# EAGLE design cnc-ctrl-io (EAGLE 6.4)
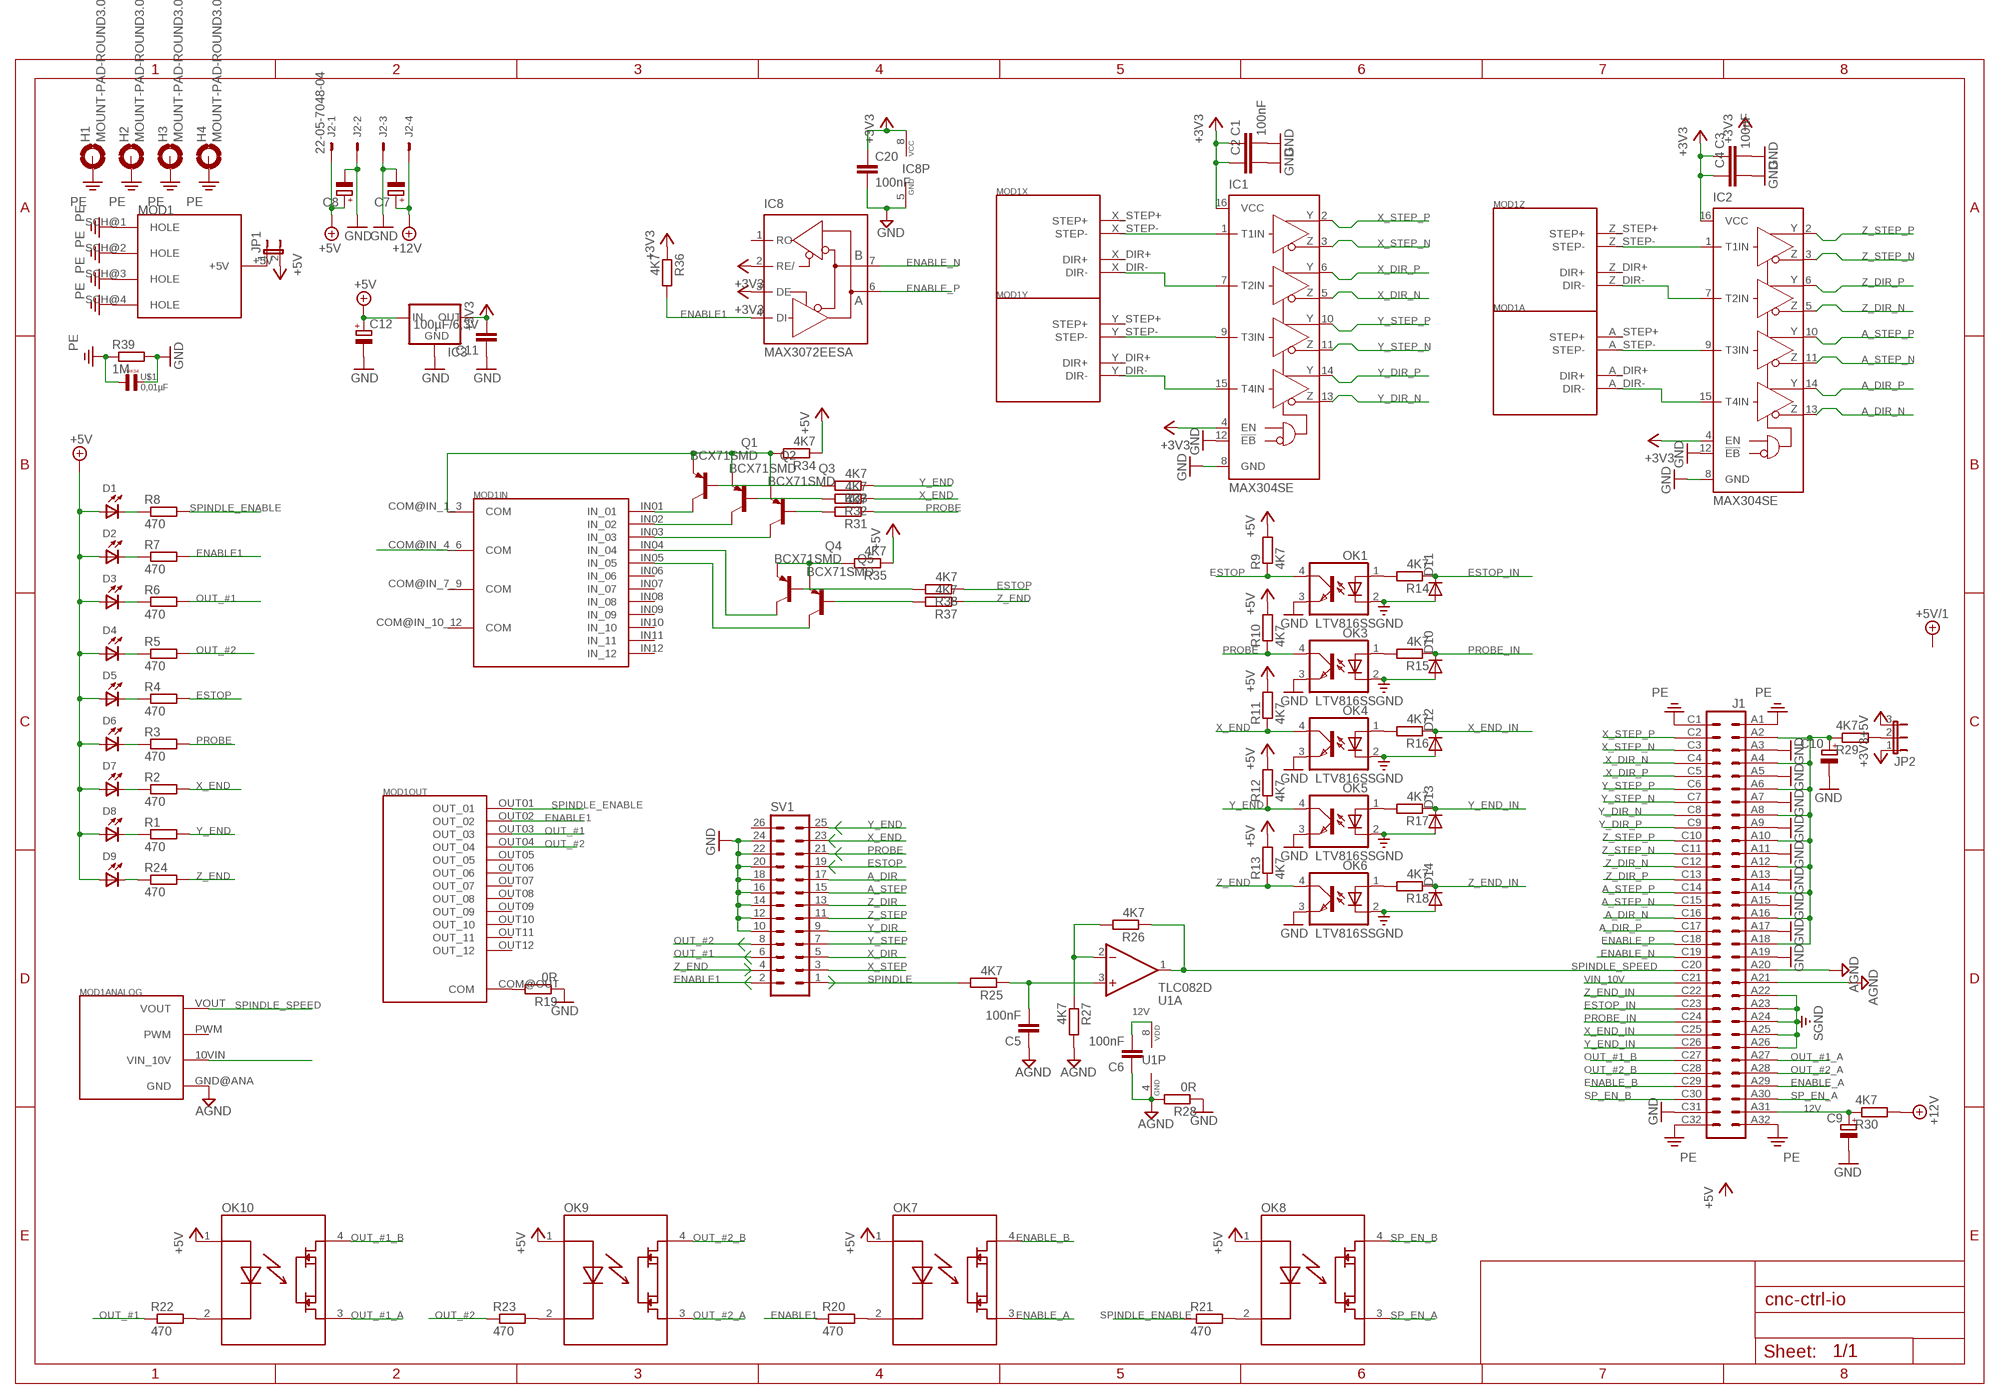
[diagram p0: schematic, sheet 1]

## Parts
C1  100nF  C-EUC0603K  [C0603K]
C2  C-EUC0603  [C0603]
C3  100nF  C-EUC0603K  [C0603K]
C4  C-EUC0603  [C0603]
C5  100nF  C-EUC0603K  [C0603K]
C6  100nF  C-EUC0603K  [C0603K]
C7  CPOL-EUE3.5-8  [E3,5-8]
C8  CPOL-EUE3.5-8  [E3,5-8]
C9  CPOL-EUE2.5-5  [E2,5-5]
C10  CPOL-EUE2.5-5  [E2,5-5]
C11  100µF/6,3V  C-EUC1206  [C1206]
C12  CPOL-EUE2.5-5  [E2,5-5]
C20  100nF  C-EUC0603  [C0603]
D1  DL1  [DL1N]
D2  DL1  [DL1N]
D3  DL1  [DL1N]
D4  DL1  [DL1N]
D5  DL1  [DL1N]
D6  DL1  [DL1N]
D7  DL1  [DL1N]
D8  DL1  [DL1N]
D9  DL1  [DL1N]
D10  DIODE-SMB  [SMB]
D11  DIODE-SMB  [SMB]
D12  DIODE-SMB  [SMB]
D13  DIODE-SMB  [SMB]
D14  DIODE-SMB  [SMB]
H1  MOUNT-PAD-ROUND3.0  [3,0-PAD]
H2  MOUNT-PAD-ROUND3.0  [3,0-PAD]
H3  MOUNT-PAD-ROUND3.0  [3,0-PAD]
H4  MOUNT-PAD-ROUND3.0  [3,0-PAD]
IC1  MAX304SE  [SO16]
IC2  MAX304SE  [SO16]
IC3  LM1117TO252  [TO252]
IC8  MAX3072EESA  MAX481CSA  [SO08]
J1  VG64  [VG64]
J2  22-05-7048-04  [7395-04]
JP1  JP1E  [JP1]
JP2  JP2E  [JP2]
MOD1  DDLMV1  [DDLMV1]
OK1  LTV816S  [SMD4]
OK3  LTV816S  [SMD4]
OK4  LTV816S  [SMD4]
OK5  LTV816S  [SMD4]
OK6  LTV816S  [SMD4]
OK7  AQY280  [DIL4-SMD]
OK8  AQY280  [DIL4-SMD]
OK9  AQY280  [DIL4-SMD]
OK10  AQY280  [DIL4-SMD]
Q1  BCX71SMD  [SOT23]
Q2  BCX71SMD  [SOT23]
Q3  BCX71SMD  [SOT23]
Q4  BCX71SMD  [SOT23]
Q5  BCX71SMD  [SOT23]
R1  470  R-EU_R0603  [R0603]
R2  470  R-EU_R0603  [R0603]
R3  470  R-EU_R0603  [R0603]
R4  470  R-EU_R0603  [R0603]
R5  470  R-EU_R0603  [R0603]
R6  470  R-EU_R0603  [R0603]
R7  470  R-EU_R0603  [R0603]
R8  470  R-EU_R0603  [R0603]
R9  4K7  R-EU_R0603  [R0603]
R10  4K7  R-EU_R0603  [R0603]
R11  4K7  R-EU_R0603  [R0603]
R12  4K7  R-EU_R0603  [R0603]
R13  4K7  R-EU_R0603  [R0603]
R14  4K7  R-EU_R0603  [R0603]
R15  4K7  R-EU_R0603  [R0603]
R16  4K7  R-EU_R0603  [R0603]
R17  4K7  R-EU_R0603  [R0603]
R18  4K7  R-EU_R0603  [R0603]
R19  0R  R-EU_R0603  [R0603]
R20  470  R-EU_R0603  [R0603]
R21  470  R-EU_R0603  [R0603]
R22  470  R-EU_R0603  [R0603]
R23  470  R-EU_R0603  [R0603]
R24  470  R-EU_R0603  [R0603]
R25  4K7  R-EU_R0603  [R0603]
R26  4K7  R-EU_R0603  [R0603]
R27  4K7  R-EU_R0603  [R0603]
R28  0R  R-EU_R0603  [R0603]
R29  4K7  R-EU_R0603  [R0603]
R30  4K7  R-EU_R0603  [R0603]
R31  4K7  R-EU_R0603  [R0603]
R32  4K7  R-EU_R0603  [R0603]
R33  4K7  R-EU_R0603  [R0603]
R34  4K7  R-EU_R0603  [R0603]
R35  4K7  R-EU_R0603  [R0603]
R36  4K7  R-EU_R0603  [R0603]
R37  4K7  R-EU_R0603  [R0603]
R38  4K7  R-EU_R0603  [R0603]
R39  1M  R-EU_R0603  [R0603]
SV1  ML26  [ML26]
U1  TLC082D  [SO08]
U$1  0,01µF  [R7K5B3]

## Nets
12V: C6.2 C9.+ J1.A31 R30.1 U1.8(P:VDD)
+3V3: C1.1 C2.1 C3.1 C4.1 C11.2 C20.1 IC1.4(EN) IC1.16(VCC) IC2.4(EN) IC2.16(VCC) IC3.3(OUT) IC8.2(RE/) IC8.3(DE) IC8.8(VCC) JP2.1 R36.1
+5V: C8.+ C12.+ D1.A D2.A D3.A D4.A D5.A D6.A D7.A D8.A D9.A IC3.2(IN) J2.1 JP1.2 JP2.3 OK7.1 OK8.1 OK9.1 OK10.1 R9.2 R10.2 R11.2 R12.2 R13.2 R34.1 R35.1
+12V: C7.+ J2.4 R30.2
A_DIR: IC2.15(T4IN) MOD1.A_DIR-(DIR-) SV1.17
A_DIR_N [diff_rs485]: IC2.13(Z4) J1.C16
A_DIR_P [diff_rs485]: IC2.14(Y4) J1.C17
A_STEP: IC2.9(T3IN) MOD1.A_STEP-(STEP-) SV1.15
A_STEP_N [diff_rs485]: IC2.11(Z3) J1.C15
A_STEP_P [diff_rs485]: IC2.10(Y3) J1.C14
AGND: C5.1 C6.1 J1.A20 J1.A21 MOD1.GND@ANA(GND) R27.2 R28.2 U1.4(P:GND)
COM@IN_1_3: MOD1.COM@IN_1_3(COM) Q1.2(E) Q2.2(E) Q3.2(E) R34.2
COM@IN_4_6: MOD1.COM@IN_4_6(COM) Q4.2(E) Q5.2(E) R35.2
ENABLE1: IC8.4(DI) MOD1.OUT02(OUT_02) R7.2 R20.1 R36.2 SV1.2
ENABLE_A: J1.A29 OK7.3
ENABLE_B: J1.C29 OK7.4
ENABLE_N [diff_rs485]: IC8.7(B) J1.C19
ENABLE_P [diff_rs485]: IC8.6(A) J1.C18
ESTOP: OK1.4(COL) R4.2 R9.1 R38.1 SV1.19
ESTOP_IN: D11.C J1.C23 R14.1
GND: C1.2 C2.2 C3.2 C4.2 C7.- C8.- C9.- C10.- C11.1 C12.- C20.2 IC1.8(GND) IC1.12(!EB) IC2.8(GND) IC2.12(!EB) IC3.1(GND) IC8.5(GND) J1.A3 J1.A5 J1.A7 J1.A9 J1.A11 J1.A13 J1.A15 J1.A17 J1.A19 J1.C31 J2.2 J2.3 OK1.3(EMIT) OK3.3(EMIT) OK4.3(EMIT) OK5.3(EMIT) OK6.3(EMIT) R19.1 R28.1 R39.2 SV1.10 SV1.12 SV1.14 SV1.16 SV1.18 SV1.20 SV1.22 SV1.24 U$1.2
IF_PWR: C10.+ J1.A2 J1.A4 J1.A6 J1.A8 J1.A10 J1.A12 J1.A14 J1.A16 J1.A18 R29.1
N$1: OK9.2 R23.2
N$2: D1.C R8.1
N$3: D2.C R7.1
N$4: D3.C R6.1
N$5: D4.C R5.1
N$6: D5.C R4.1
N$7: D6.C R3.1
N$8: D7.C R2.1
N$9: D8.C R1.1
N$10: OK1.1(A) R14.2
N$11: OK3.1(A) R15.2
N$12: OK4.1(A) R16.2
N$13: OK5.1(A) R17.2
N$14: OK6.1(A) R18.2
N$15: MOD1.COM@OUT(COM) R19.2
N$16: OK7.2 R20.2
N$17: OK8.2 R21.2
N$18: OK10.2 R22.2
N$20: D9.C R24.1
N$21: MOD1.IN01(IN_01) Q1.3(C)
N$22: JP1.1 MOD1.+5V
N$23: C5.2 R25.1 U1.3(A:+IN)
N$24: R26.2 R27.1 U1.2(A:-IN)
N$25: JP2.2 R29.2
N$26: MOD1.10VIN(VIN_10V)
N$27: MOD1.IN02(IN_02) Q2.3(C)
N$28: MOD1.IN03(IN_03) Q3.3(C)
N$29: MOD1.IN04(IN_04) Q4.3(C)
N$30: Q3.1(B) R31.2
N$31: Q2.1(B) R32.2
N$32: Q1.1(B) R33.2
N$33: MOD1.IN05(IN_05) Q5.3(C)
N$36: Q5.1(B) R37.2
N$37: Q4.1(B) R38.2
OUT_#1: MOD1.OUT03(OUT_03) R6.2 R22.1 SV1.6
OUT_#1_A: J1.A27 OK10.3
OUT_#1_B: J1.C27 OK10.4
OUT_#2: MOD1.OUT04(OUT_04) R5.2 R23.1 SV1.8
OUT_#2_A: J1.A28 OK9.3
OUT_#2_B: J1.C28 OK9.4
PE: H1.B3,0(MOUNT) H2.B3,0(MOUNT) H3.B3,0(MOUNT) H4.B3,0(MOUNT) J1.A1 J1.A32 J1.C1 J1.C32 MOD1.SCH@1(HOLE) MOD1.SCH@2(HOLE) MOD1.SCH@3(HOLE) MOD1.SCH@4(HOLE) R39.1 U$1.1
PROBE: OK3.4(COL) R3.2 R10.1 R31.1 SV1.21
PROBE_IN: D10.C J1.C24 R15.1
SGND: D10.A D11.A D12.A D13.A D14.A J1.A22 J1.A23 J1.A24 J1.A25 J1.A26 OK1.2(C) OK3.2(C) OK4.2(C) OK5.2(C) OK6.2(C)
SP_EN_A: J1.A30 OK8.3
SP_EN_B: J1.C30 OK8.4
SPINDLE: R25.2 SV1.1
SPINDLE_ENABLE: MOD1.OUT01(OUT_01) R8.2 R21.1
SPINDLE_SPEED: J1.C20 MOD1.VOUT R26.1 U1.1(A:OUT)
VIN_10V: J1.C21
X_DIR: IC1.7(T2IN) MOD1.X_DIR-(DIR-) SV1.5
X_DIR_N [diff_rs485]: IC1.5(Z2) J1.C4
X_DIR_P [diff_rs485]: IC1.6(Y2) J1.C5
X_END: OK4.4(COL) R2.2 R11.1 R32.1 SV1.23
X_END_IN: D12.C J1.C25 R16.1
X_STEP: IC1.1(T1IN) MOD1.X_STEP-(STEP-) SV1.3
X_STEP_N [diff_rs485]: IC1.3(Z1) J1.C3
X_STEP_P [diff_rs485]: IC1.2(Y1) J1.C2
Y_DIR: IC1.15(T4IN) MOD1.Y_DIR-(DIR-) SV1.9
Y_DIR_N [diff_rs485]: IC1.13(Z4) J1.C8
Y_DIR_P [diff_rs485]: IC1.14(Y4) J1.C9
Y_END: OK5.4(COL) R1.2 R12.1 R33.1 SV1.25
Y_END_IN: D13.C J1.C26 R17.1
Y_STEP: IC1.9(T3IN) MOD1.Y_STEP-(STEP-) SV1.7
Y_STEP_N [diff_rs485]: IC1.11(Z3) J1.C7
Y_STEP_P [diff_rs485]: IC1.10(Y3) J1.C6
Z_DIR: IC2.7(T2IN) MOD1.Z_DIR-(DIR-) SV1.13
Z_DIR_N [diff_rs485]: IC2.5(Z2) J1.C12
Z_DIR_P [diff_rs485]: IC2.6(Y2) J1.C13
Z_END: OK6.4(COL) R13.1 R24.2 R37.1 SV1.4
Z_END_IN: D14.C J1.C22 R18.1
Z_STEP: IC2.1(T1IN) MOD1.Z_STEP-(STEP-) SV1.11
Z_STEP_N [diff_rs485]: IC2.3(Z1) J1.C11
Z_STEP_P [diff_rs485]: IC2.2(Y1) J1.C10
Unconnected: IC8.1(RO) MOD1.A_DIR+(DIR+) MOD1.A_STEP+(STEP+) MOD1.B_DIR+(DIR+) MOD1.B_DIR-(DIR-) MOD1.B_STEP+(STEP+) MOD1.B_STEP-(STEP-) MOD1.COM@IN_7_9(COM) MOD1.COM@IN_10_12(COM) MOD1.IN06(IN_06) MOD1.IN07(IN_07) MOD1.IN08(IN_08) MOD1.IN09(IN_09) MOD1.IN10(IN_10) MOD1.IN11(IN_11) MOD1.IN12(IN_12) MOD1.OUT05(OUT_05) MOD1.OUT06(OUT_06) MOD1.OUT07(OUT_07) MOD1.OUT08(OUT_08) MOD1.OUT09(OUT_09) MOD1.OUT10(OUT_10) MOD1.OUT11(OUT_11) MOD1.OUT12(OUT_12) MOD1.PWM MOD1.X_DIR+(DIR+) MOD1.X_STEP+(STEP+) MOD1.Y_DIR+(DIR+) MOD1.Y_STEP+(STEP+) MOD1.Z_DIR+(DIR+) MOD1.Z_STEP+(STEP+) SV1.26 U1.5(B:+IN) U1.6(B:-IN) U1.7(B:OUT)

## Library data of the parts
C1-C6 C11 C20 = rcl:C-EU: CAPACITOR, European symbol
C7-C10 C12 = rcl:CPOL-EU: POLARIZED CAPACITOR, European symbol
D1-D9 = opto:DL: LED
D10-D14 = diode:DIODE-: DIODE
H1-H4 = holes:MOUNT-PAD-ROUND: MOUNTING PAD, round
IC1 IC2 = maxim:MAX304*: ±10kV ESD-Protected, Quad 5V RS-485/422 Transmitters Source: MAX3040-MAX3045.pdf
IC3 = v-reg-3:LM1117
IC8 = maxim:MAX481CSA: RS485 TRANSEIVER
J1 = 19inch:VG64: PCB EUROCARD, 64-pin type C/AC, 2.54 mm
J2 = con-molex:22-?-04: CONNECTOR wire to board 2.54 mm (.1 inch) pitch header; OC_FARNELL: unknown; OC_NEWARK: unknown
JP1 = jumper:JP1E: JUMPER
JP2 = jumper:JP2E: JUMPER
MOD1 = ddlmv1:DDLMV1
OK1 OK3-OK6 = optocoupler:LTV816: OPTO COUPLER Source: LITEON, LTV816.pdf; OC_FARNELL: unknown; OC_NEWARK: unknown
OK7-OK10 = optocoupler:AQY280
Q1-Q5 = transistor-pnp:BCX71SMD: PNP Transistor
R1-R39 = rcl:R-EU_: RESISTOR, European symbol
SV1 = con-ml:ML26: HARTING; OC_FARNELL: unknown; OC_NEWARK: unknown
U1 = op-amp:TLC082: BiMOS OP-AMP Single Supply
U$1 = Capacitor-Wima-MKS4-250v:0,01µF

## Net classes
1 diff_rs485: width 0.305 mm, drill 0.203 mm, clearance 0.305 mm

## Board
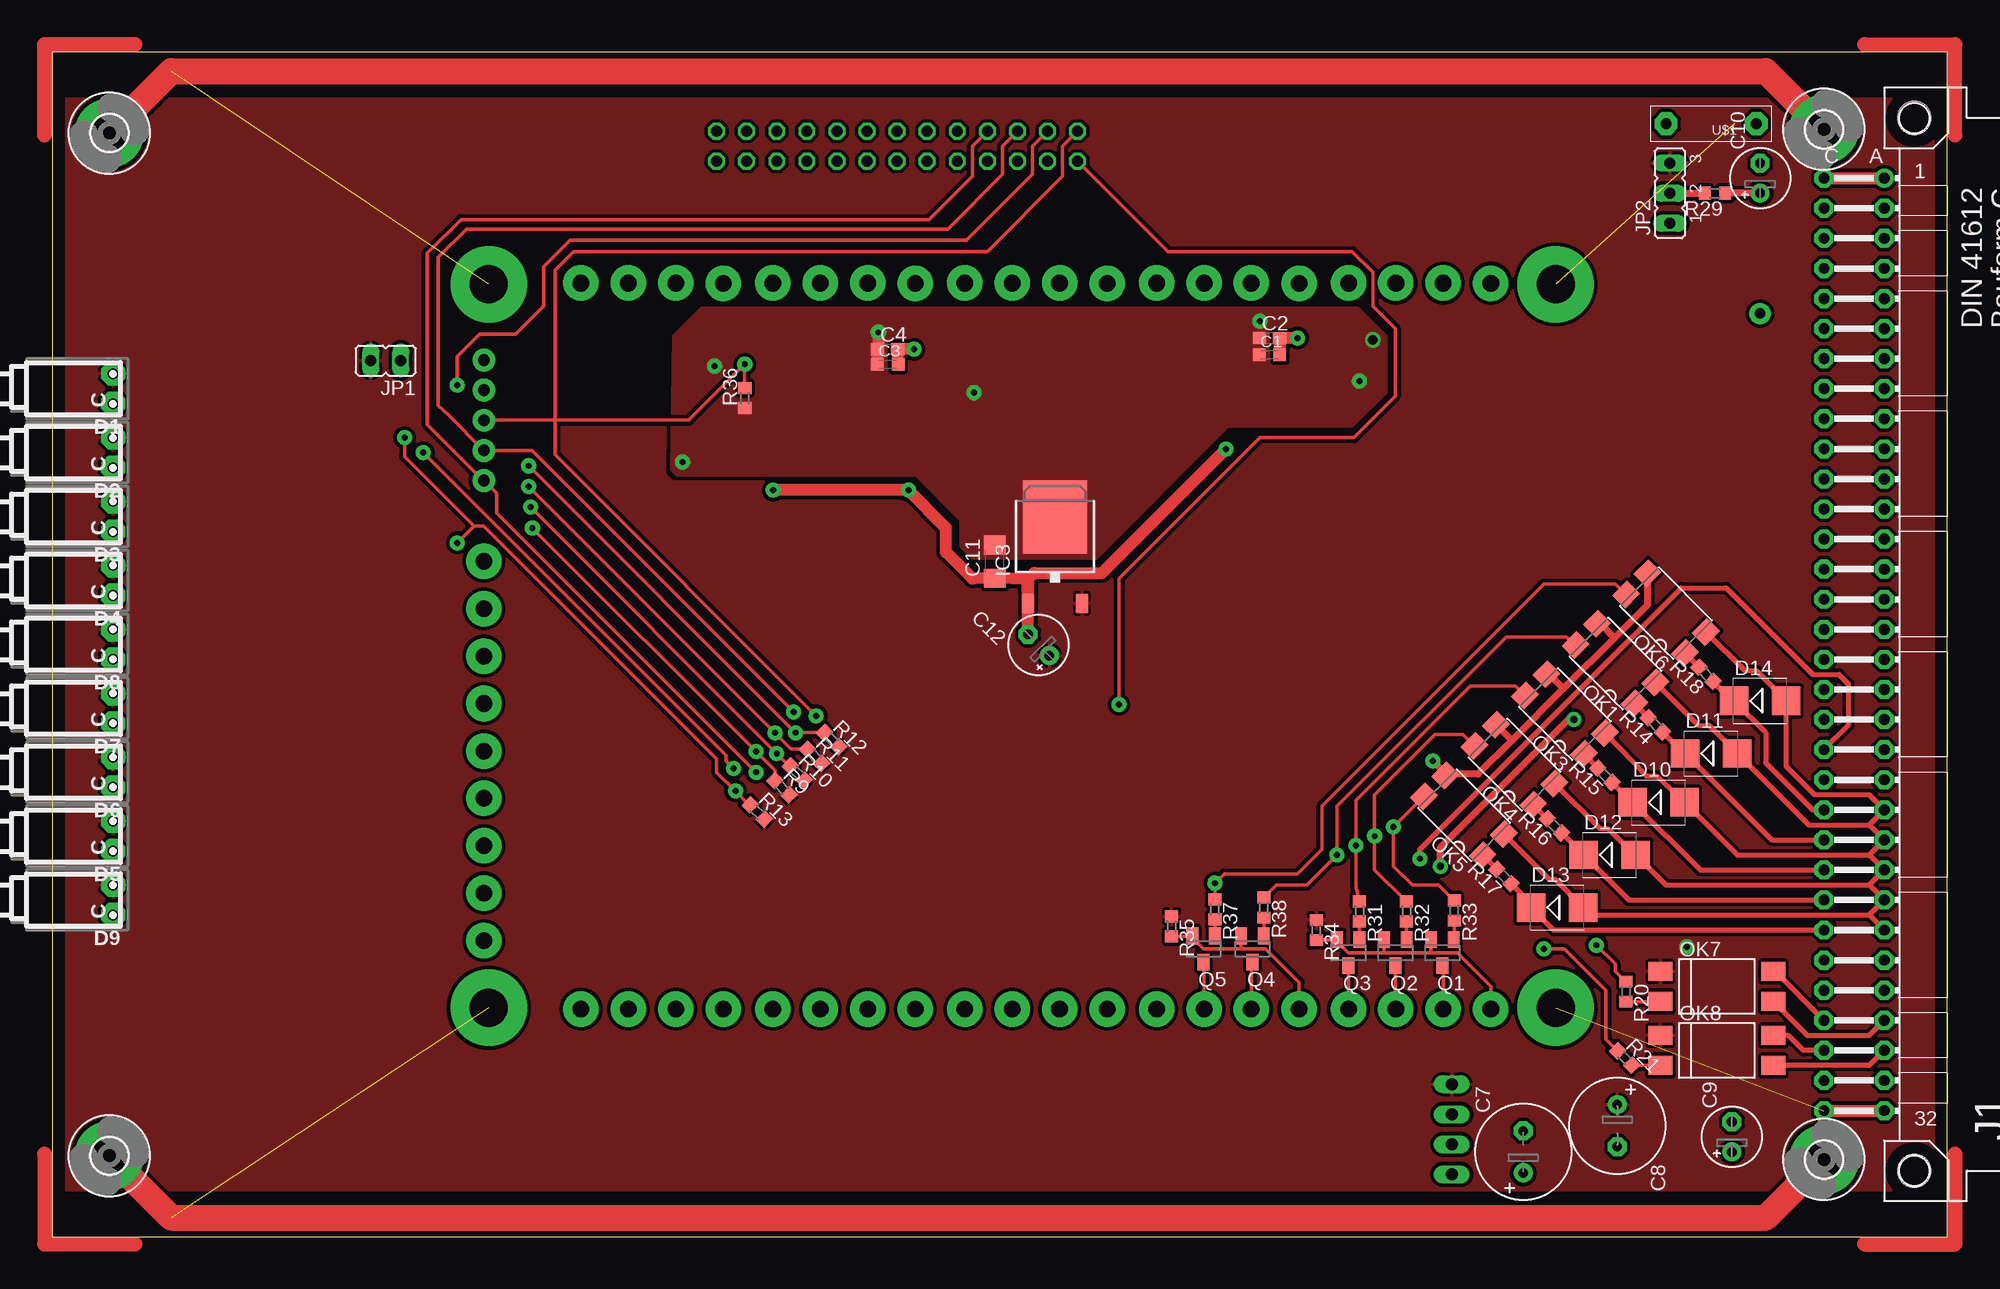
[diagram p1: board, top side]
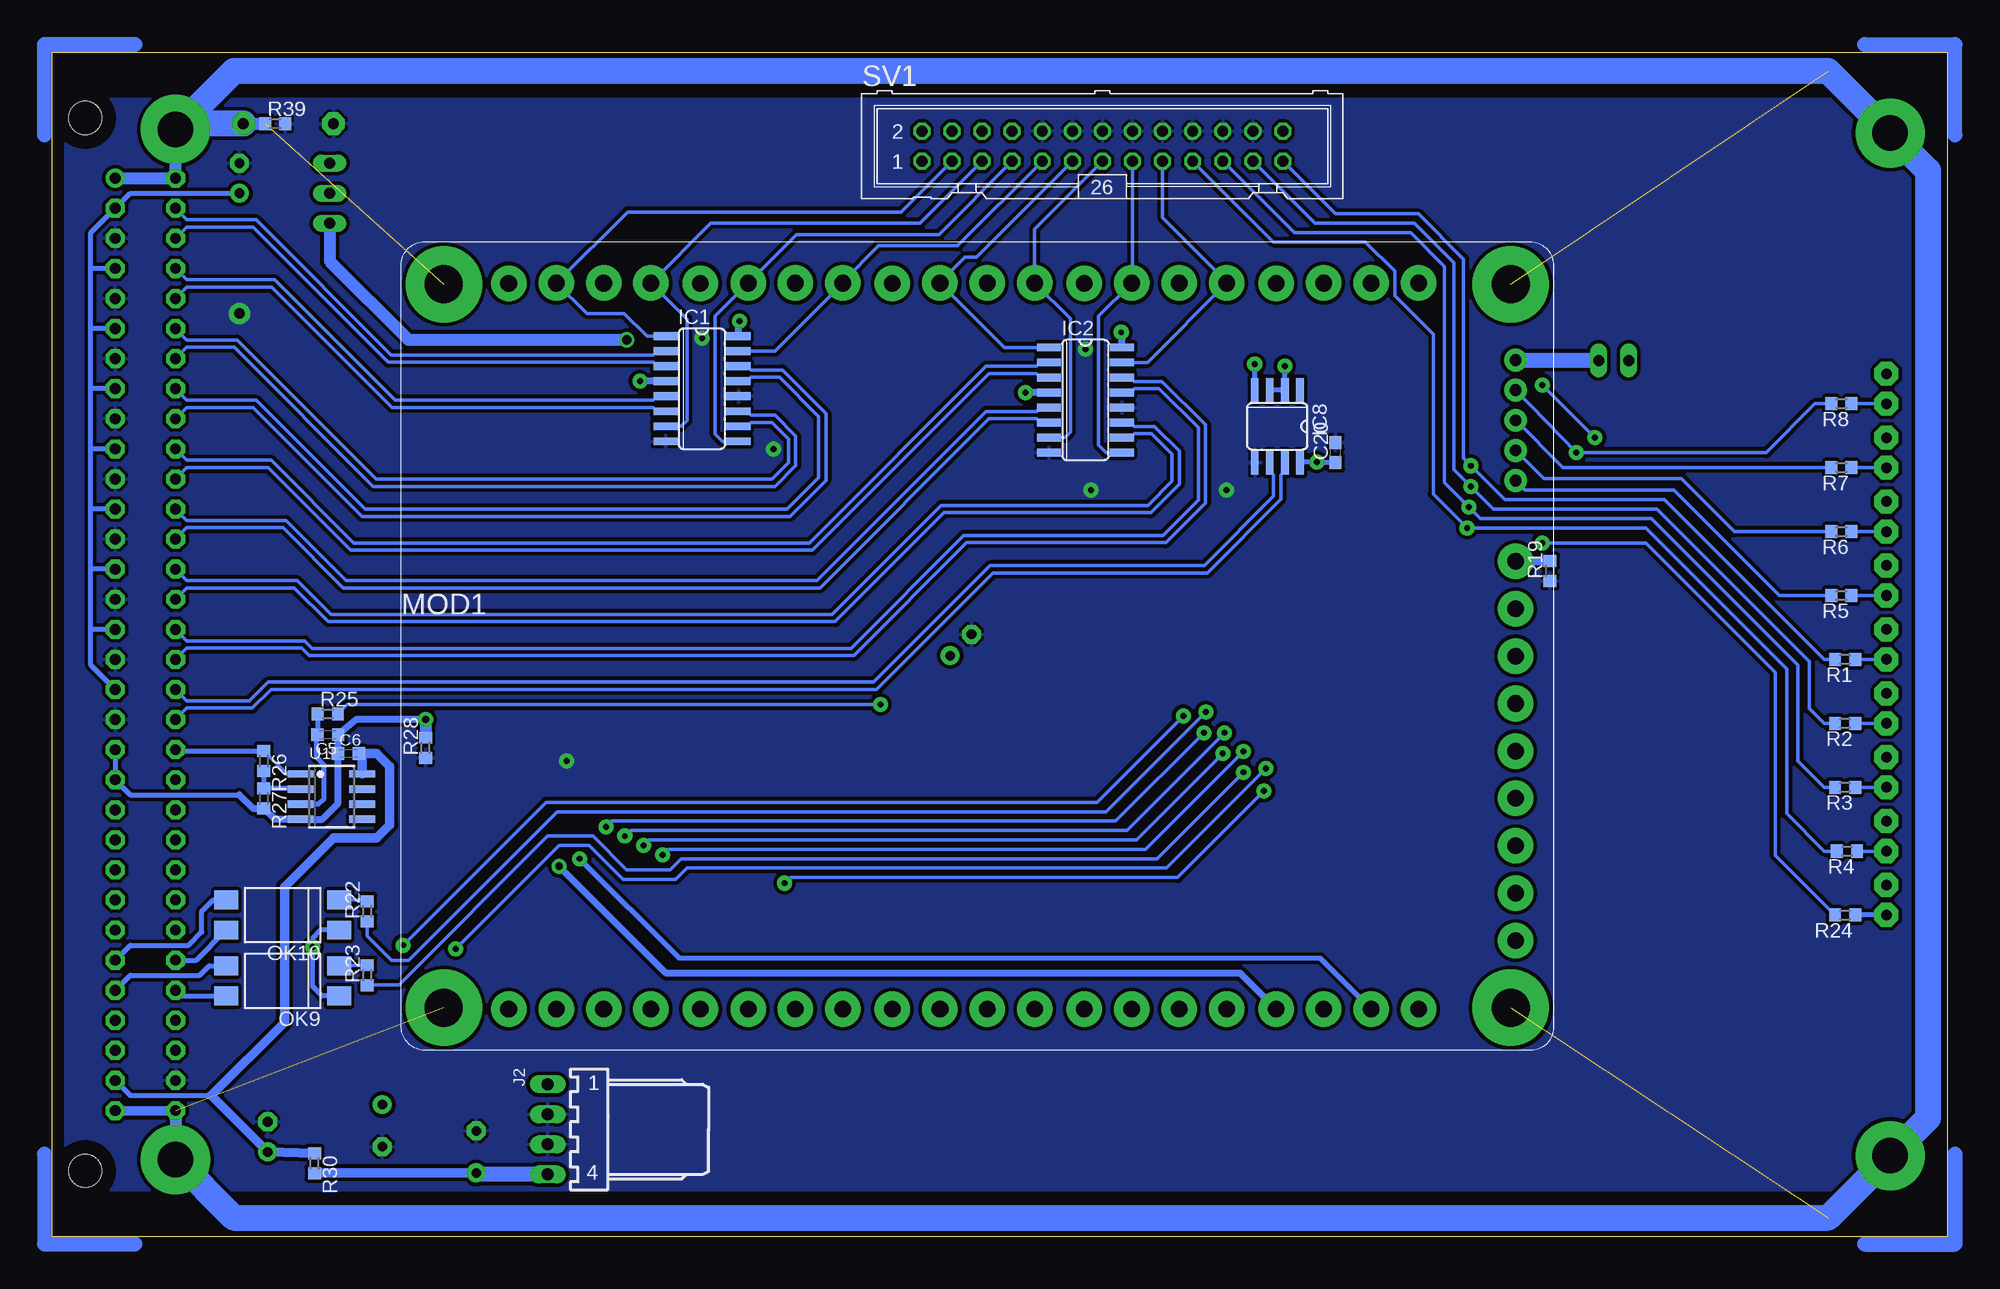
[diagram p2: board, bottom side, seen from below]

Size 160.02 x 100.03 mm. Coordinates in mm from the lower left corner, seen from the top.
Copper layers (1*16): Top 0.035mm / dielectric 1.5mm / Bottom 0.035mm
Design rules "default": minimum track width 10mil, minimum drill 24mil, track to track 8mil, track to pad 8mil, pad to pad 8mil, via to via 8mil, smd to smd 8mil, copper to edge 40mil, drill to drill 8mil, minimum pad ring 10mil, minimum via ring 8mil, stop-mask expansion 4mil, vias tented up to drill 0mil, thermal gap 10mil

### Footprints (pad centres in the part's own frame; a part is rotated, then mirrored left to right if it is on the bottom)
C0603K = smd 1.05 x 1.08: 1 -0.875,0; 2 0.875,0
C0603 = smd 1.1 x 1: 1 -0.85,0; 2 0.85,0
E3,5-8 = drill 0.813 pad 1.6: + -1.778,0 | drill 0.813 pad 1.6 octagon: - 1.778,0
E2,5-5 = drill 0.813 pad 1.6: + -1.27,0 | drill 0.813 pad 1.6 octagon: - 1.27,0
C1206 = smd 1.6 x 1.8: 1 -1.4,0; 2 1.4,0
DL1N = drill 0.889 pad 2.032 octagon: A 2.54,0; C 0,0
SMB = smd 2.4 x 2.4: A 2.2,0; C -2.2,0
3,0-PAD = drill 3 pad 5.842: B3,0 0,0
SO16 = smd 0.66 x 2.032: 1 -4.445,-3.073; 2 -3.175,-3.073; 3 -1.905,-3.073; 4 -0.635,-3.073; 5 0.635,-3.073; 6 1.905,-3.073; 7 3.175,-3.073; 8 4.445,-3.073; 9 4.445,3.073; 10 3.175,3.073; 11 1.905,3.073; 12 0.635,3.073; 13 -0.635,3.073; 14 -1.905,3.073; 15 -3.175,3.073; 16 -4.445,3.073
TO252 = smd 1 x 1.6: 1 -2.28,-6.07; 2 2.28,-6.07 | smd 5.4 x 6.2: 3 0,1.23
SO08 = smd 0.66 x 2.032: 1 -1.905,-3.073; 2 -0.635,-3.073; 3 0.635,-3.073; 4 1.905,-3.073; 5 1.905,3.073; 6 0.635,3.073; 7 -0.635,3.073; 8 -1.905,3.073
VG64 = drill 0.914 pad 1.6: A1 154.94,39.37 | drill 0.914 pad 1.6 octagon: A2 154.94,36.83; A3 154.94,34.29; A4 154.94,31.75; A5 154.94,29.21; A6 154.94,26.67; A7 154.94,24.13; A8 154.94,21.59; A9 154.94,19.05; A10 154.94,16.51; A11 154.94,13.97; A12 154.94,11.43; A13 154.94,8.89; A14 154.94,6.35; A15 154.94,3.81; A16 154.94,1.27; A17 154.94,-1.27; A18 154.94,-3.81; A19 154.94,-6.35; A20 154.94,-8.89; A21 154.94,-11.43; A22 154.94,-13.97; A23 154.94,-16.51; A24 154.94,-19.05; A25 154.94,-21.59; A26 154.94,-24.13; A27 154.94,-26.67; A28 154.94,-29.21; A29 154.94,-31.75; A30 154.94,-34.29; A31 154.94,-36.83; A32 154.94,-39.37; C1 149.86,39.37; C2 149.86,36.83; C3 149.86,34.29; C4 149.86,31.75; C5 149.86,29.21; C6 149.86,26.67; C7 149.86,24.13; C8 149.86,21.59; C9 149.86,19.05; C10 149.86,16.51; C11 149.86,13.97; C12 149.86,11.43; C13 149.86,8.89; C14 149.86,6.35; C15 149.86,3.81; C16 149.86,1.27; C17 149.86,-1.27; C18 149.86,-3.81; C19 149.86,-6.35; C20 149.86,-8.89; C21 149.86,-11.43; C22 149.86,-13.97; C23 149.86,-16.51; C24 149.86,-19.05; C25 149.86,-21.59; C26 149.86,-24.13; C27 149.86,-26.67; C28 149.86,-29.21; C29 149.86,-31.75; C30 149.86,-34.29; C31 149.86,-36.83; C32 149.86,-39.37 | hole 2.794: 157.48,44.45; 157.48,-44.45
7395-04 = drill 1.016 long: 1 3.81,0; 2 1.27,0; 3 -1.27,0; 4 -3.81,0
JP1 = drill 0.914 long: 1 0,-1.27; 2 0,1.27
JP2 = drill 0.914 long: 1 -2.54,0; 2 0,0; 3 2.54,0
DDLMV1 = drill 1.4 pad 3: 10VIN 85.9,3.5; A_DIR+ 65.7,64.8; A_DIR- 69.7,64.8; A_STEP+ 57.681,64.793; A_STEP- 61.7,64.8; B_DIR+ 81.9,64.8; B_DIR- 85.9,64.8; B_STEP+ 73.88,64.793; B_STEP- 77.9,64.8; COM@IN_1_3 9.081,3.493; COM@IN_4_6 25.28,3.493; COM@IN_7_9 41.48,3.493; COM@IN_10_12 57.681,3.493; COM@OUT 94.1,41.3; GND@ANA 73.88,3.493; IN01 13.1,3.5; IN02 17.1,3.5; IN03 21.1,3.5; IN04 29.3,3.5; IN05 33.3,3.5; IN06 37.3,3.5; IN07 45.5,3.5; IN08 49.5,3.5; IN09 53.5,3.5; IN10 61.7,3.5; IN11 65.7,3.5; IN12 69.7,3.5; OUT05 94.1,37.3; OUT06 94.1,33.3; OUT07 94.1,29.3; OUT08 94.108,25.28; OUT09 94.1,21.3; OUT10 94.1,17.3; OUT11 94.1,13.3; OUT12 94.108,9.28; PWM 77.9,3.5; VOUT 81.9,3.5; X_DIR+ 17.1,64.8; X_DIR- 21.1,64.8; X_STEP+ 9.081,64.793; X_STEP- 13.1,64.8; Y_DIR+ 33.3,64.8; Y_DIR- 37.3,64.8; Y_STEP+ 25.28,64.793; Y_STEP- 29.3,64.8; Z_DIR+ 49.5,64.8; Z_DIR- 53.5,64.8; Z_STEP+ 41.48,64.793; Z_STEP- 45.5,64.8 | drill 1 pad 1.93: +5V 94.107,58.293; OUT01 94.107,55.753; OUT02 94.107,53.213; OUT03 94.107,50.673; OUT04 94.107,48.133 | drill 3.2 pad 6.452: SCH@1 3.6,3.6; SCH@2 93.7,3.6; SCH@3 93.7,64.7; SCH@4 3.6,64.7
SMD4 = smd 1.78 x 1.55: 1 -1.27,-3.5; 2 1.27,-3.5; 3 1.27,3.5; 4 -1.27,3.5
DIL4-SMD = smd 1.6 x 2: 1 -1.27,-4.77; 2 1.27,-4.77; 3 1.27,4.77; 4 -1.27,4.77
SOT23 = smd 1 x 1.4: 1 -0.95,-1.1; 2 0.95,-1.1; 3 0,1.1
R0603 = smd 1 x 1.1: 1 -0.85,0; 2 0.85,0
ML26 = drill 0.914 octagon: 1 -15.24,-1.27; 2 -15.24,1.27; 3 -12.7,-1.27; 4 -12.7,1.27; 5 -10.16,-1.27; 6 -10.16,1.27; 7 -7.62,-1.27; 8 -7.62,1.27; 9 -5.08,-1.27; 10 -5.08,1.27; 11 -2.54,-1.27; 12 -2.54,1.27; 13 0,-1.27; 14 0,1.27; 15 2.54,-1.27; 16 2.54,1.27; 17 5.08,-1.27; 18 5.08,1.27; 19 7.62,-1.27; 20 7.62,1.27; 21 10.16,-1.27; 22 10.16,1.27; 23 12.7,-1.27; 24 12.7,1.27; 25 15.24,-1.27; 26 15.24,1.27
SO08' = smd 0.6 x 2.2: 1 -1.905,-2.6; 2 -0.635,-2.6; 3 0.635,-2.6; 4 1.905,-2.6; 5 1.905,2.6; 6 0.635,2.6; 7 -0.635,2.6; 8 -1.905,2.6
R7K5B3 = drill 0.914 pad 1.905 octagon: 1 -3.81,0; 2 3.81,0

### Placement (x,y rotation side)
C1  102.77,74.46 0 top
C2  102.77,75.89 0 top
C3  70.55,73.67 0 top
C4  70.55,74.94 0 top
C5  136.75,42.39 180 bottom
C6  135,40.81 0 bottom
C7  124.21,7.15 90 top
C8  132.14,9.37 270 top
C9  141.83,8.42 90 top
C10  144.21,89.38 90 top
C11  79.6,57 90 top
C12  83.29,49.97 135 top
C20  51.66,66.21 90 bottom
D1  5.14,70.33 90 top
D2  5.14,64.94 90 top
D3  5.14,59.54 90 top
D4  5.14,54.14 90 top
D5  5.14,32.55 90 top
D6  5.14,37.95 90 top
D7  5.14,43.35 90 top
D8  5.14,48.74 90 top
D9  5.14,27.15 90 top
D10  135.64,36.68 0 top
D11  140.08,40.81 0 top
D12  131.51,32.23 0 top
D13  127.06,27.79 0 top
D14  144.21,45.25 0 top
H1  149.61,6.52 0 top
H2  149.61,93.51 0 top
H3  4.83,6.83 0 top
H4  4.83,93.19 0 top
IC1  105.16,71.6 270 bottom
IC2  72.77,70.65 270 bottom
IC3  84.68,59.54 0 top
IC8  56.58,68.43 180 bottom
J1  -0.25,50.01 0 top
J2  118.17,9.06 90 bottom
JP1  28.16,73.98 90 top
JP2  136.59,88.11 90 top
MOD1  130.56,15.72 0 bottom
OK1  132,48.38 45 top
OK3  127.74,44.12 45 top
OK4  123.47,39.85 45 top
OK5  119.21,35.59 45 top
OK6  136.27,52.65 45 top
OK7  140.56,21.12 270 top
OK8  140.56,15.72 270 top
OK9  140.56,21.6 90 bottom
OK10  140.56,27.15 90 bottom
Q1  117.38,23.98 180 top
Q2  113.41,23.98 180 top
Q3  109.44,23.98 180 top
Q4  101.35,24.3 180 top
Q5  97.22,24.3 180 top
R1  8.64,48.74 180 bottom
R2  8.64,43.35 180 bottom
R3  8.64,37.95 180 bottom
R4  8.48,32.55 180 bottom
R5  8.95,54.14 180 bottom
R6  8.95,59.54 180 bottom
R7  8.95,64.94 180 bottom
R8  8.95,70.33 180 bottom
R9  61.62,37.91 315 top
R10  62.91,39.16 315 top
R11  64.36,40.57 315 top
R12  65.81,41.97 315 top
R13  59.54,35.87 315 top
R14  135.37,43.22 135 top
R15  131.1,38.95 135 top
R16  126.84,34.69 135 top
R17  122.57,30.42 135 top
R18  139.64,47.49 135 top
R19  33.56,56.2 90 bottom
R20  132.89,20.69 270 top
R21  132.78,15.09 315 top
R22  133.41,27.47 90 bottom
R23  133.41,22.07 90 bottom
R24  8.64,27.15 180 bottom
R25  136.75,44.14 0 bottom
R26  142.14,40.17 270 bottom
R27  142.14,37 270 bottom
R28  128.49,41.28 90 bottom
R29  140.4,88.11 180 top
R30  137.86,6.2 270 bottom
R31  110.39,27.47 270 top
R32  114.36,27.47 270 top
R33  118.38,27.53 270 top
R34  106.74,25.88 270 top
R35  94.52,26.2 270 top
R36  58.48,70.81 90 top
R37  98.17,27.63 270 top
R38  102.3,27.79 270 top
R39  141.19,93.99 0 bottom
SV1  71.34,92.08 0 bottom
U1  TLC082D  [SO08']  136.43,37.15 270 bottom
U$1  140.08,93.99 180 top

### Tracks (layer width: path | path; a pad name or v marks a point on that pad's centre or on a via)
12V
  Bottom 0.406: J1.A31 153.42,11.91 146.59,11.91
  Bottom 0.813: R30.1 C9.+ 146.59,11.91 140.4,18.1 140.4,29.53 136.27,33.66 132.62,33.66 131.51,34.77 131.51,39.69 132.62,40.81 C6.2 133.83,40.51 U1.8
+3V3  (via drill 0.5 pad 1.27, 0.8 pad 1.27)
  Top 1.016: v69.75,76.36 69.75,75.15 | C3.1 69.67,74.91 C4.1
  Bottom 0.406: v55.94,73.51 IC8.2 IC8.3 | IC8.8 54.62,65.41 v53.25,65.41 51.71,65.41 C20.1 | 69.7,76.31 v69.75,76.36
  Bottom 0.61: IC2.4 v77.85,71.29 | IC1.4 v110.39,72.24 | IC2.16 69.7,76.31 | IC1.16 102.08,77.22 v101.98,77.32
  Bottom 1.016: JP2.1 136.59,82.4 129.92,75.73 v111.51,75.73
  pour Top (isolate 0.305, rank 2, no thermals): 112.62,76.05 110.24,78.43 54.83,78.43 52.45,76.05 52.29,64.78 52.77,64.3 72.93,64.3 76.74,60.49 76.74,58.27 77.69,57.32 88.17,57.32 99.28,68.43 109.76,68.43 112.62,71.29
+5V  (via drill 0.5 pad 1.27)
  Bottom 0.406: OK10.1 137.38,25.88 138.02,25.25 v138.02,24.45 138.02,21.12 137.22,20.33 OK9.1
  pour Top (isolate 0.305, rank 3): 1.02,3.98 158.81,3.98 158.81,96.05 1.02,96.05
+12V
  Bottom 0.813: C7.+ 137.57,5.37 R30.2
  Bottom 1.27: J2.4 124.08,5.25 C7.+
A_DIR
  Bottom 0.305: IC2.15 67.55,73.82 MOD1.A_DIR- 60.86,80.64 66.26,86.05 SV1.17
A_DIR_N
  Bottom 0.305: IC2.13 68.97,71.29 68.64,71.62 66.55,71.62 63.23,68.3 63.23,62.2 66.23,59.21 83.06,59.21 92.58,49.68 138.05,49.68 138.69,50.32 148.65,50.32 149.61,51.27 J1.C16
A_DIR_P
  Bottom 0.305: IC2.14 68.97,72.56 68.64,72.22 66.3,72.22 62.62,68.55 62.62,61.95 65.98,58.6 82.8,58.6 92.33,49.07 138.3,49.07 138.94,49.71 148.65,49.71 149.61,48.76 J1.C17
A_STEP
  Bottom 0.305: IC2.9 71.02,66.2 71.66,66.84 71.66,77.72 MOD1.A_STEP- 68.8,80.58 SV1.15
A_STEP_N
  Bottom 0.305: IC2.11 68.97,68.75 68.64,68.41 66.93,68.41 64.85,66.33 64.85,63.54 67.25,61.14 84.71,61.14 93.92,51.93 136.72,51.93 139.57,54.79 148.65,54.79 149.61,53.84 J1.C15
A_STEP_P
  Bottom 0.305: IC2.10 68.97,67.47 68.64,67.81 67.18,67.81 65.46,66.08 65.46,63.79 67.5,61.75 84.96,61.75 94.17,52.54 136.46,52.54 139.32,55.4 148.65,55.4 149.61,56.35 J1.C14
AGND  (via drill 0.6 pad 1.27)
  Top 0.61: v117.22,31.28 117.22,32.87 128.02,43.66 v128.49,43.66
  Bottom 0.406: 144.21,37.31 153.42,37.31 J1.A21 J1.A20 | C6.1
  Bottom 0.61: 144.21,37.31 143.04,36.15 R27.2 141.19,35.25 U1.4 137.22,35.25 135.88,36.6 C6.1 | C6.1 C5.1 134.37,43.66 v128.49,43.66 | MOD1.GND@ANA 59.69,22.23 108.17,22.23 v117.22,31.28
  Bottom 1.016: v128.49,43.66 R28.2
COM@IN_1_3
  Top 0.305: 112.46,23.98 109.44,23.98 108.49,24.93 Q3.2 106.79,25.08 R34.2 | 112.46,23.98 116.59,23.98 | 116.59,23.98 118.65,23.98 121.48,21.15 MOD1.COM@IN_1_3 | Q2.2 112.46,23.98 | Q1.2 116.43,24.13 116.59,23.98
COM@IN_4_6
  Top 0.305: R35.2 96.22,25.35 Q5.2 96.27,25.25 97.22,24.29 100.39,24.29 | 100.39,24.29 102.46,24.29 105.27,21.48 MOD1.COM@IN_4_6 | Q4.2 100.4,24.3 100.39,24.29
ENABLE1  (via drill 0.5 pad 1.27)
  Top 0.305: 42.45,68.97 MOD1.OUT02 53.75,68.94 v58.48,73.67 R36.2 | 42.45,68.97 42.45,81.6 44.04,83.19 78.96,83.19 85.31,89.54 85.31,92.08 SV1.2 | v64.52,43.98 42.45,66.05 42.45,68.97 | v130.4,24.61 131.99,23.02 131.99,22.39 132.84,21.54 R20.1
  Bottom 0.305: R7.2 32.45,64.93 MOD1.OUT02 | v64.52,43.98 71.82,36.68 118.33,36.68 v130.4,24.61
  Bottom 0.406: IC8.4 v58.48,73.67
ENABLE_A
  Top 0.406: OK7.3 148.19,16.99 153.42,16.99 J1.A29
ENABLE_B
  Top 0.406: J1.C29 145.48,22.39 OK7.4
ENABLE_N
  Bottom 0.305: IC8.7 55.94,64.63 56.27,64.3 56.27,62.27 62.48,56.06 80.58,56.06 90.42,46.22 141.54,46.22 143.13,44.63 148.65,44.63 149.61,43.68 J1.C19
ENABLE_P
  Bottom 0.305: IC8.6 57.21,64.63 56.88,64.3 56.88,62.52 62.74,56.67 80.83,56.67 90.68,46.82 141.8,46.82 143.38,45.24 148.65,45.24 149.61,46.19 J1.C18
ESTOP  (via drill 0.5 pad 1.27)
  Top 0.305: v40.55,59.85 v59.44,40.96 61.02,39.38 R9.1 | R38.1 103.35,29.69 105.95,29.69 v108.49,32.23 108.49,36.36 122.78,50.65 127.86,50.65 128.54,49.96 OK1.4
  Bottom 0.305: SV1.19 56.9,83.98 49.12,83.98 46.66,81.52 46.66,79.46 43.4,76.21 43.4,62.71 v40.55,59.85 25.46,59.85 13.56,47.95 13.56,35.73 10.38,32.55 R4.2 | v59.44,40.96 67.69,32.71 108.01,32.71 v108.49,32.23
ESTOP_IN
  Top 0.406: J1.C23 145.18,33.5 D11.C 137.78,40.81 R14.1
GND  (via drill 0.5 pad 1.27, 0.9 pad 1.78)
  Top 0.61: OK6.3 134.69,53.35 131.91,50.57 | 131.91,50.57 127.62,46.28 | 127.62,46.28 123.25,41.92 | 123.25,41.92 120.4,39.06 117.73,39.06 117.7,39.03 | v116.59,40.17 117.7,39.03 | 117.7,39.03 OK5.3 | OK4.3 121.94,43.23 123.25,41.92 | OK3.3 126.41,47.49 127.62,46.28 | OK1.3 130.72,51.76 131.91,50.57
  Top 1.016: v105.16,75.89 C2.2 103.62,74.49 C1.2 | v72.77,74.94 C4.2 71.4,73.69 C3.2 | C12.- 82.45,55.57 82.93,56.04 88.65,56.04 v99.12,66.52 | IC3.1 82.36,55.53 C11.1 77.69,55.57 75.47,57.79 75.47,59.85 v72.3,63.03 v60.87,63.03
  other vias: 144.21,77.95
  pour Bottom (isolate 0.305, rank 3): 1.02,3.98 159.45,3.98 159.45,96.05 1.02,96.05
IF_PWR
  Top 0.61: C10.+ R29.1
  Bottom 0.406: C10.+ 153.42,88.11 J1.A2 156.75,84.78 156.75,81.76 | J1.A18 156.75,48.27 156.75,51.28 | 156.75,51.28 156.75,56.36 | 156.75,56.36 156.75,61.44 | 156.75,61.44 156.75,66.52 | 156.75,66.52 156.75,71.6 | 156.75,71.6 156.75,76.68 | 156.75,76.68 156.75,81.76 | J1.A4 156.75,81.76 | J1.A6 156.75,76.68 | J1.A8 156.75,71.6 | J1.A10 156.75,66.52 | J1.A12 156.75,61.44 | J1.A14 156.75,56.36 | J1.A16 156.75,51.28
N$1
  Bottom 0.305: R23.2 135.73,22.92 OK9.2
N$2
  Bottom 0.305: D1.C R8.1
N$3
  Bottom 0.305: D2.C R7.1
N$4
  Bottom 0.305: D3.C R6.1
N$5
  Bottom 0.305: D4.C R5.1
N$6
  Bottom 0.305: D5.C R4.1
N$7
  Bottom 0.305: D6.C R3.1
N$8
  Bottom 0.305: D7.C R2.1
N$9
  Bottom 0.305: D8.C R1.1
N$10
  Top 0.406: OK1.1 R14.2 | R14.2
N$11
  Top 0.406: OK3.1 R15.2 | R15.2
N$12
  Top 0.406: R16.2 OK4.1 | OK4.1
N$13
  Top 0.406: OK5.1 R17.2 | R17.2
N$14
  Top 0.406: OK6.1 R18.2
N$15
  Bottom 0.61: MOD1.COM@OUT 33.8,57.02 R19.2
N$16
  Top 0.305: OK7.2 135.78,19.84 R20.2
N$17
  Top 0.305: R21.2 133.41,14.45 OK8.2
N$18
  Bottom 0.305: OK10.2 133.52,28.42 R22.2
N$20
  Bottom 0.406: D9.C R24.1
N$21
  Top 0.305: MOD1.IN01 117.46,22.8 Q1.3
N$22
  Bottom 1.27: MOD1.+5V 29.46,74.02 JP1.1
N$23
  Bottom 0.406: R25.1 137.62,44.11 C5.2 137.7,42.32 137.7,40.49 137.06,39.85 137.06,36.99 137.54,36.52 U1.3
N$24
  Bottom 0.406: U1.2 139.09,37.84 R27.1 R26.2
N$25
  Top 0.61: JP2.2 R29.2
N$27
  Top 0.305: Q2.3 113.41,19.27 MOD1.IN02
N$28
  Top 0.305: Q3.3 109.44,19.24 MOD1.IN03
N$29
  Top 0.305: MOD1.IN04 101.26,23.11 Q4.3
N$30
  Top 0.305: R31.2 Q3.1
N$31
  Top 0.305: R32.2 Q2.1
N$32
  Top 0.305: R33.2 118.38,25.13 Q1.1
N$33
  Top 0.305: MOD1.IN05 97.26,23.16 Q5.3
N$36
  Top 0.305: R37.2 Q5.1
N$37
  Top 0.305: R38.2 Q4.1
OUT_#1  (via drill 0.5 pad 1.27)
  Top 0.305: SV1.6 80.23,92.08 80.23,89.7 75.63,85.1 34.99,85.1 32.61,82.72 32.61,70.17 33.46,69.38 MOD1.OUT03 36.48,66.36 40.55,66.36 v62.61,44.3
  Bottom 0.305: R6.2 18,59.54 22.48,64.01 34.07,64.01 MOD1.OUT03 | v62.61,44.3 71.02,35.88 117.38,35.88 129.92,23.34 131.35,23.34 133.41,25.41 R22.1
OUT_#1_A
  Bottom 0.406: J1.A27 153.42,24.61 148.5,24.61 147.38,25.72 147.38,27.47 146.43,28.42 OK10.3
OUT_#1_B
  Bottom 0.406: J1.C27 147.87,23.34 OK10.4
OUT_#2  (via drill 0.5 pad 1.27)
  Top 0.305: SV1.8 77.69,92.08 77.69,89.54 74.04,85.89 34.51,85.89 31.65,83.03 31.65,68.59 36.39,63.86 MOD1.OUT04 37.53,62.78 37.53,61.13 v59.44,39.22
  Bottom 0.305: R5.2 14.19,54.14 23.11,63.06 35.66,63.06 MOD1.OUT04 | v59.44,39.22 66.74,31.91 106.9,31.91 107.85,30.96 111.51,30.96 114.36,33.82 118.17,33.82 130.72,21.28 133.36,21.28 R23.1
OUT_#2_A
  Bottom 0.406: J1.A28 153.42,22.07 147.54,22.07 146.75,22.87 OK9.3
OUT_#2_B
  Bottom 0.406: J1.C28 149.13,20.33 OK9.4
PE  (4 unrouted)
  Top 1.016: H1.B3,0 J1.C32 J1.A32 | H2.B3,0 J1.C1 J1.A1
  Top 2.184: H4.B3,0 10.07,98.43 144.69,98.43 H2.B3,0 | H3.B3,0 10.07,1.59 144.69,1.59 H1.B3,0
  Bottom 0.813: J1.A32 J1.C32
  Bottom 1.016: J1.A1 J1.C1 H2.B3,0 | J1.C32 H1.B3,0 | U$1.1 R39.1
  Bottom 2.184: H1.B3,0 144.69,1.59 10.07,1.59 H3.B3,0 1.65,10.01 1.65,90.02 H4.B3,0 10.07,98.43 144.69,98.43 H2.B3,0 149.13,93.99 U$1.1
PROBE  (via drill 0.5 pad 1.27)
  Top 0.305: v40.39,61.6 v61.18,40.81 62.23,39.76 R10.1 | R31.1 110.08,29.59 v110.08,33.03 110.08,36.84 119.76,46.52 123.54,46.52 OK3.4
  Bottom 0.305: SV1.21 55.15,84.78 45.31,84.78 42.45,81.92 42.45,63.66 v40.39,61.6 39.43,60.65 24.99,60.65 12.61,48.27 12.61,40.17 10.38,37.95 R3.2 | v61.18,40.81 68.48,33.5 109.6,33.5 v110.08,33.03
PROBE_IN
  Top 0.406: J1.C24 139.15,30.96 D10.C 133.38,36.68 R15.1
SGND
  Top 0.406: 153.42,27.15 129.9,27.15 D13.A 129.26,27.81 126.91,30.17 126.42,30.17 OK5.2 | 153.42,27.15 J1.A26 | 153.42,29.69 136.25,29.69 D12.A 133.57,32.23 131.35,34.46 130.67,34.46 OK4.2 | 153.42,29.69 J1.A25 153.42,27.15 | 153.5,32.15 153.42,32.23 142.28,32.23 D10.A 137.84,36.7 135.48,38.9 134.59,38.9 OK3.2 | 153.5,32.15 J1.A24 153.42,29.69 | 153.42,34.77 148.31,34.77 D11.A 142.28,40.83 139.92,43.19 139,43.19 OK1.2 | 153.42,34.77 J1.A23 153.5,32.31 153.5,32.15 | OK6.2 142.92,47.79 143.89,47.79 146.41,45.27 D14.A 146.41,39.72 148.81,37.31 153.42,37.31 J1.A22 153.42,34.77
SP_EN_A
  Top 0.406: J1.A30 153.42,14.45 OK8.3
SP_EN_B
  Top 0.406: J1.C30 147.86,15.72 146.59,16.99 OK8.4
SPINDLE  (via drill 0.5 pad 1.27)
  Top 0.305: SV1.1 94.2,83.19 109.76,83.19 111.51,81.45 111.51,78.59 113.41,76.68 113.41,70.97 109.92,67.47 101.98,67.47 90.07,55.57 v90.07,44.93
  Bottom 0.305: R25.2 135.1,44.93 v90.07,44.93
SPINDLE_ENABLE  (via drill 0.5 pad 1.27)
  Top 0.305: v31.34,66.2 56.9,40.65 56.9,40.17 v57.53,39.54 | v125.95,24.29 127.7,24.29 131.19,20.8 131.19,16.68 R21.1
  Bottom 0.305: R8.2 11.18,70.33 15.3,66.2 v31.34,66.2 MOD1.OUT01 | v57.53,39.54 65.94,31.12 106.43,31.12 107.38,30.17 111.82,30.17 114.68,33.03 117.22,33.03 v125.95,24.29
SPINDLE_SPEED  (via drill 0.5 pad 1.27)
  Top 0.406: v115.47,31.91 115.47,32.71 137.54,54.78 141.35,54.78 148.65,47.47 150.88,47.47 151.67,46.68 151.67,43.19 J1.C20
  Bottom 0.305: R26.1 140.18,39.06 U1.1
  Bottom 0.406: J1.C20 149.5,41.02 R26.1 | MOD1.VOUT 52.94,23.5 107.06,23.5 v115.47,31.91
X_DIR
  Bottom 0.305: IC1.7 106.9,68.43 106.43,68.9 106.43,77.49 MOD1.X_DIR- 104.41,85.57 86.74,85.57 SV1.5
X_DIR_N
  Bottom 0.305: IC1.5 108.95,70.97 109.28,70.64 131.06,70.64 141.23,80.8 148.65,80.8 149.61,81.75 J1.C4
X_DIR_P
  Bottom 0.305: IC1.6 108.95,69.7 109.28,70.03 131.32,70.03 141.48,80.19 148.65,80.19 149.61,79.24 J1.C5
X_END  (via drill 0.5 pad 1.27)
  Top 0.305: v40.23,63.35 v61.02,42.55 62.41,41.17 R11.1 | R32.1 111.66,30.96 v111.66,33.82 111.66,37.31 116.74,42.39 119.13,42.39 OK4.4
  Bottom 0.305: SV1.23 53.4,85.57 44.99,85.57 41.66,82.24 41.66,64.78 v40.23,63.35 38.32,61.44 24.51,61.44 11.65,48.58 11.65,44.62 10.38,43.34 R2.2 | v61.02,42.55 69.28,34.3 111.19,34.3 v111.66,33.82
X_END_IN
  Top 0.406: J1.C25 133.12,28.42 D12.C 127.45,34.09 R16.1
X_STEP
  Bottom 0.305: IC1.1 109.81,76.05 111.71,77.95 114.84,77.95 MOD1.X_STEP- 111.45,86.53 88.33,86.53 SV1.3
X_STEP_N
  Bottom 0.305: IC1.3 108.95,73.51 109.28,73.84 131.64,73.84 143.06,85.27 148.65,85.27 148.65,85.25 J1.C3
X_STEP_P
  Bottom 0.305: IC1.2 108.95,74.78 109.28,74.45 131.38,74.45 142.81,85.88 148.65,85.88 148.65,85.89 J1.C2
Y_DIR
  Bottom 0.305: IC1.15 99,74.78 MOD1.Y_DIR- 93.26,80.65 90.23,83.67 83.57,83.67 SV1.9
Y_DIR_N
  Bottom 0.305: IC1.13 101.36,72.24 101.03,72.57 98.61,72.57 95.3,69.25 95.3,64.11 97.98,61.43 133.61,61.43 142.81,70.64 148.65,70.64 149.61,71.59 J1.C8
Y_DIR_P
  Bottom 0.305: IC1.14 101.36,73.51 101.03,73.18 98.36,73.18 94.69,69.51 94.69,63.86 97.73,60.82 133.86,60.82 143.06,70.03 148.65,70.03 149.61,69.08 J1.C9
Y_END  (via drill 0.5 pad 1.27)
  Top 0.305: v40.23,65.09 v62.77,42.55 62.79,42.58 R12.1 | R33.1 118.33,28.43 118.32,28.43 117.06,29.69 114.84,29.69 113.25,31.28 v113.25,34.61 115.8,37.16 OK5.4
  Bottom 0.305: SV1.25 51.66,86.37 44.67,86.37 40.86,82.56 40.86,65.73 v40.23,65.09 37.37,62.24 23.88,62.24 10.38,48.74 R1.2 | v62.77,42.55 70.23,35.09 112.78,35.09 v113.25,34.61
Y_END_IN
  Top 0.406: J1.C26 126.77,25.88 D13.C 124.86,28.13 R17.1
Y_STEP
  Bottom 0.305: IC1.9 103.41,67.16 104.05,67.79 104.05,77.73 MOD1.Y_STEP- 97.16,84.62 85.15,84.62 SV1.7
Y_STEP_N
  Bottom 0.305: IC1.11 101.36,69.7 101.03,69.37 99,69.37 97.23,67.6 97.23,65.13 99,63.36 132.91,63.36 144.65,75.11 148.65,75.11 149.61,74.16 J1.C7
Y_STEP_P
  Bottom 0.305: IC1.10 101.36,68.43 101.03,68.76 99.25,68.76 97.84,67.35 97.84,65.38 99.25,63.97 132.65,63.97 144.4,75.72 148.65,75.72 149.61,76.67 J1.C6
Z_DIR
  Bottom 0.305: IC2.7 74.52,67.47 74.04,67.95 74.04,77.51 MOD1.Z_DIR- 77.06,85.1 SV1.13
Z_DIR_N
  Bottom 0.305: IC2.5 76.57,70.02 76.9,69.68 81.15,69.68 95.44,55.4 135.19,55.4 140.27,60.48 148.65,60.48 149.61,61.43 J1.C12
Z_DIR_P
  Bottom 0.305: IC2.6 76.57,68.75 76.9,69.08 80.9,69.08 95.19,54.79 135.45,54.79 140.53,59.87 148.65,59.87 149.61,58.92 J1.C13
Z_END  (via drill 0.5 pad 1.27)
  Top 0.305: SV1.4 82.77,92.08 82.77,89.7 77.22,84.14 43.72,84.14 41.5,81.92 41.5,78.59 39.12,76.21 36.1,76.21 34.2,74.3 v34.2,71.92 | v29.75,67.47 29.75,65.89 35.62,60.01 | v34.2,58.58 35.62,60.01 | 35.62,60.01 36.42,60.01 56.1,40.33 56.1,39.22 v57.69,37.63 58.85,36.47 R13.1 | R37.1 v98.17,29.85 98.96,30.65 105.16,30.65 107.22,32.71 107.22,36.36 125.95,55.09 131.99,55.09 132.85,54.23 OK6.4
  Bottom 0.305: R24.2 14.51,32.18 14.51,47.63 25.46,58.58 v34.2,58.58 | v34.2,71.92 v29.75,67.47 | v57.69,37.63 64.99,30.33 97.69,30.33 v98.17,29.85
Z_END_IN
  Top 0.406: R18.1 141.87,45.25 D14.C 144.69,42.57 144.69,40.01 148.65,36.04 J1.C22
Z_STEP
  Bottom 0.305: IC2.1 79.63,75.09 MOD1.Z_STEP- 85.06,80.59 82.93,82.72 81.98,82.72 SV1.11
Z_STEP_N
  Bottom 0.305: IC2.3 76.57,72.56 76.9,72.89 80.9,72.89 95.82,57.96 134.81,57.96 141.8,64.95 148.65,64.95 149.61,64 J1.C11
Z_STEP_P
  Bottom 0.305: IC2.2 76.57,73.82 76.9,73.49 81.15,73.49 96.07,58.57 134.56,58.57 141.54,65.56 148.65,65.56 149.61,66.51 J1.C10